# Altium schematic sheet Sodonguyenly.SchDoc
size A4
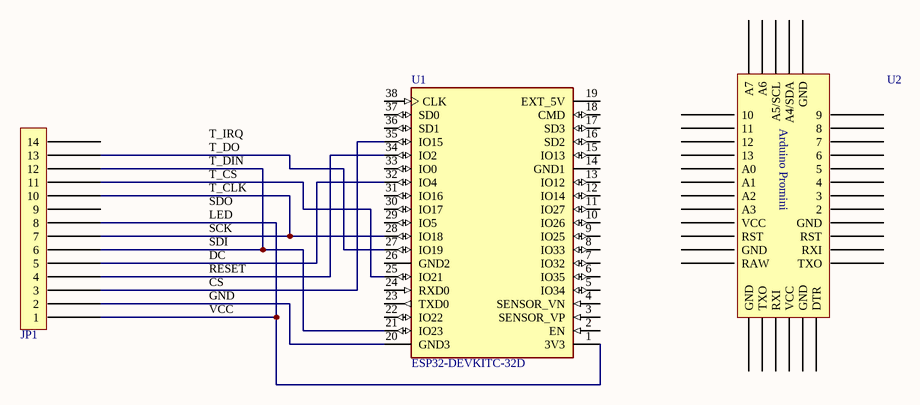
[diagram p0: Sodonguyenly.SchDoc]

## Parts
JP1  JP  [Jumper 14x1 - duplicate]  (value not drawn)
U1  ESP32-DEVKITC-32D  [MODULE_ESP32-DEVKITC-32D]
U2  Arduino Promini  [Arduino_Promini]  (value not drawn)

## Nets
NetJP1_1: JP1.1 JP1.8 U1.1(3V3)
NetJP1_2: JP1.2 U1.20(GND3)
NetJP1_3: JP1.3 U1.35(IO15)
NetJP1_4: JP1.4 U1.34(IO2)
NetJP1_5: JP1.5 U1.32(IO4)
NetJP1_6: JP1.6 JP1.12 U1.21(IO23)
NetJP1_7: JP1.7 JP1.10 U1.28(IO18)
NetJP1_11: JP1.11 U1.25(IO21)
NetJP1_13: JP1.13 U1.27(IO19)

Not connected (* = marked no-connect by the designer): JP1 9 14; U1 2(EN) 3(SENSOR_VP) 4(SENSOR_VN) 5(IO34) 6(IO35) 7(IO32) 8(IO33) 9(IO25) 10(IO26) 11(IO27) 12(IO14) 13(IO12) 14(GND1) 15(IO13) 16(SD2) 17(SD3) 18(CMD) 19(EXT_5V) 22(IO22) 23(TXD0) 24(RXD0) 26(GND2) 29(IO5) 30(IO17) 31(IO16) 33(IO0) 36(SD1) 37(SD0) 38(CLK); U2 1(9) 2(8) 3(7) 4(6) 5 6(4) 7(3) 8(2) 9(GND) 10(RST) 11(RXI) 12(TXO) 13(DTR) 14(GND) 15(VCC) 16(RXI) 17(TXO) 18(GND) 19(RAW) 20(GND) 21(RST) 22(VCC) 23(A3) 24(A2) 25(A1) 26(A0) 27(13) 28(12) 29(11) 30(10) 31(A7) 32(A6) 33(A5/SCL) 34(A4/SDA) 35(GND)

## Notes on the sheet
- T_IRQ
- SDO
- T_CLK
- T_CS
- T_DIN
- T_DO
- RESET
- DC
- SDI
- SCK
- LED
- VCC
- GND
- CS

## Library data of the parts
JP1 = Jumper 14x1
U1 = ESP32-DEVKITC-32D: EVAL BOARD FOR ESP-WROOM-32; MF: Espressif Systems; Value: *; MP: ESP32-DEVKITC-32D; Price: None; Check_prices: https://www.snapeda.com/parts/ESP32-DEVKITC-32D/Espressif%20Systems/view-part/2777395/?ref=eda; SnapEDA_Link: https://www.snapeda.com/parts/ESP32-DEVKITC-32D/Espressif%20Systems/view-part/2777395/?ref=snap; Availability: Warning; Purchase-URL: https://pricing.snapeda.com/search/part/ESP32-DEVKITC-32D/?ref=eda; Package: None